# EAGLE design ledmaster (EAGLE 5.11)
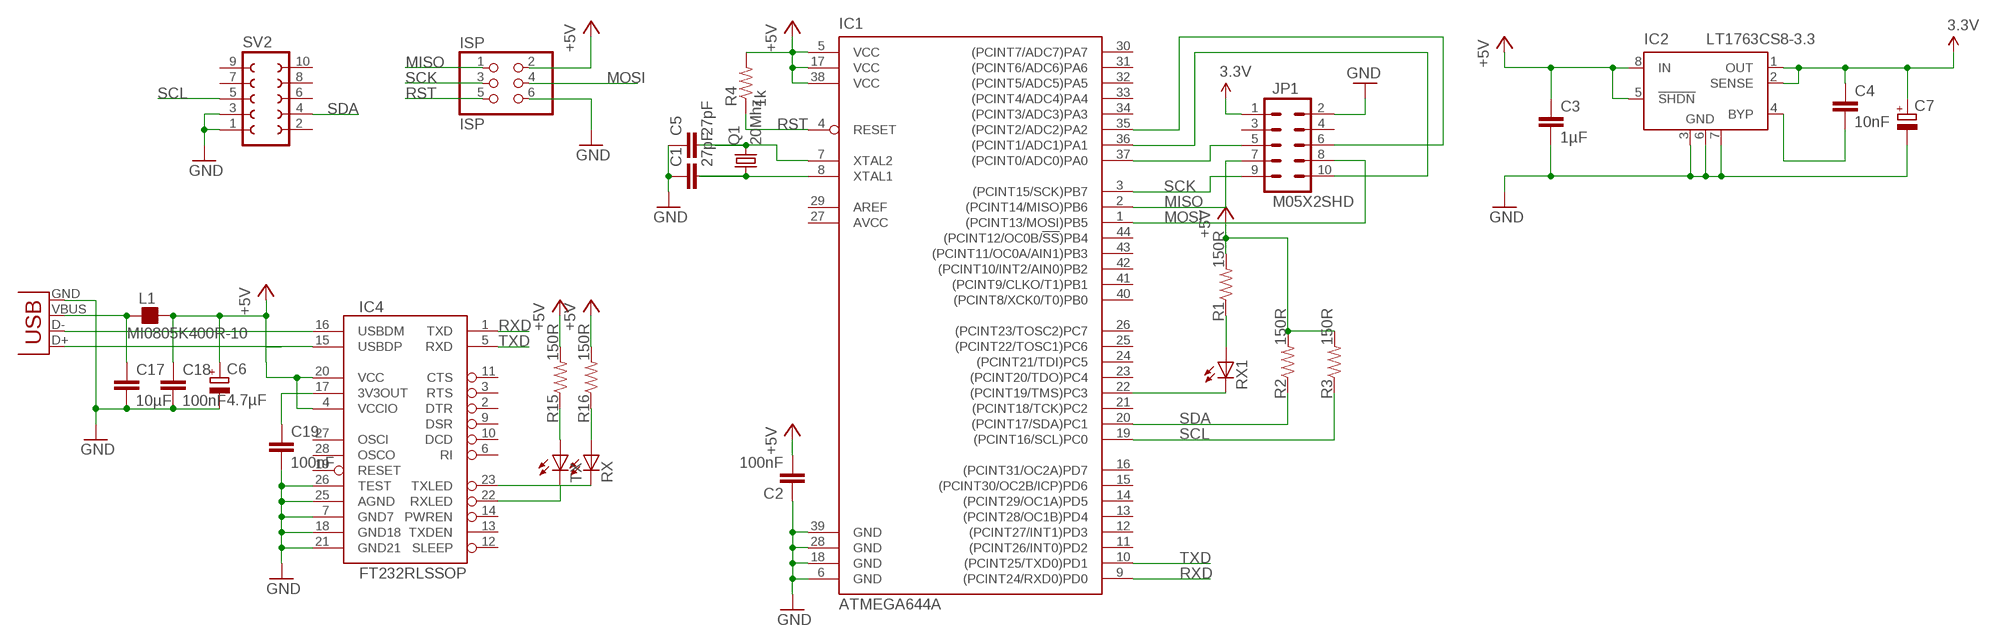
[diagram p0: schematic, sheet 1]

## Parts
C1  27pF  CAP0805  [0805]
C2  100nF  CAP0805  [0805]
C3  1µF  CAP0805  [0805]
C4  10nF  CAP0805  [0805]
C5  27pF  CAP0805  [0805]
C6  4.7µF  CPOL-EUSMCC  [SMC_C]
C7  CPOL-EUSMCC  [SMC_C]
C17  10µF  CAP0805  [0805]
C18  100nF  CAP0805  [0805]
C19  100nF  CAP0805  [0805]
IC1  ATMEGA644A  [TQFP44]
IC2  LT1763CS8-3.3  [SOIC8]
IC4  FT232RLSSOP  [SSOP28DB]
ISP  ISP  PINHD-2X03_2.54  [2X03]
JP1  M05X2SHD  [2X5-SHROUDED]
L1  MI0805K400R-10  FB_0805  [L0805]
Q1  20Mhz  CRYSTALCTS406  [CTS406]
R1  150R  RESISTOR  [0805]
R2  150R  RESISTOR  [0805]
R3  150R  RESISTOR  [0805]
R4  1k  RESISTOR  [0805]
R15  150R  RESISTOR  [0805]
R16  150R  RESISTOR  [0805]
RX  LEDCHIP-LED0805  [CHIP-LED0805]
RX1  LEDCHIP-LED0805  [CHIP-LED0805]
SV2  FE05-2W  [FE05-2W]
TX  LEDCHIP-LED0805  [CHIP-LED0805]
X1  USB-SMD-NS  [USB-MINIB-NOSTOP]

## Nets
3.3V: C4.1 C7.+ IC2.1(OUT) IC2.2(SENSE) JP1.1
+5V: C2.2 C3.1 C6.+ C18.1 IC1.5(VCC) IC1.17(VCC) IC1.38(VCC) IC2.5(!SHDN) IC2.8(IN) IC4.4(VCCIO) IC4.20(VCC) ISP.2 L1.2 R1.2 R2.2 R3.2 R4.2 R15.2 R16.2
GND: C1.1 C2.1 C3.2 C5.1 C6.- C7.- C17.2 C18.2 C19.2 IC1.6(GND) IC1.18(GND) IC1.28(GND) IC1.39(GND) IC2.3(GND) IC2.6(GND) IC2.7(GND) IC4.7(GND7) IC4.18(GND18) IC4.21(GND21) IC4.25(AGND) IC4.26(TEST) ISP.6 JP1.2 SV2.1 SV2.3 X1.GND
MISO: IC1.2((PCINT14/MISO)PB6) ISP.1 JP1.7
MOSI: IC1.1((PCINT13/MOSI)PB5) ISP.4 JP1.8
N$1: IC4.16(USBDM) X1.D-
N$2: IC4.15(USBDP) X1.D+
N$3: C4.2 IC2.4(BYP)
N$4: C17.1 L1.1 X1.VBUS
N$5: R1.1 RX1.A
N$6: IC1.22((PCINT19/TMS)PC3) RX1.C
N$7: IC1.37((PCINT0/ADC0)PA0) JP1.5
N$8: IC1.36((PCINT1/ADC1)PA1) JP1.10
N$9: IC1.35((PCINT2/ADC2)PA2) JP1.6
N$19: R15.1 TX.A
N$20: R16.1 RX.A
N$27: IC4.22(RXLED) TX.C
N$28: IC4.23(TXLED) RX.C
N$29: C19.1 IC4.17(3V3OUT)
N$30: C5.2 IC1.7(XTAL2) Q1.3
N$32: C1.2 IC1.8(XTAL1) Q1.1
RST: IC1.4(RESET) ISP.5 R4.1
RXD: IC1.9((PCINT24/RXD0)PD0) IC4.1(TXD)
SCK: IC1.3((PCINT15/SCK)PB7) ISP.3 JP1.9
SCL: IC1.19((PCINT16/SCL)PC0) R3.1 SV2.5
SDA: IC1.20((PCINT17/SDA)PC1) R2.1 SV2.4
TXD: IC1.10((PCINT25/TXD0)PD1) IC4.5(RXD)
Unconnected: IC1.11((PCINT26/INT0)PD2) IC1.12((PCINT27/INT1)PD3) IC1.13((PCINT28/OC1B)PD4) IC1.14((PCINT29/OC1A)PD5) IC1.15((PCINT30/OC2B/ICP)PD6) IC1.16((PCINT31/OC2A)PD7) IC1.21((PCINT18/TCK)PC2) IC1.23((PCINT20/TDO)PC4) IC1.24((PCINT21/TDI)PC5) IC1.25((PCINT22/TOSC1)PC6) IC1.26((PCINT23/TOSC2)PC7) IC1.29(AREF) IC1.30((PCINT7/ADC7)PA7) IC1.31((PCINT6/ADC6)PA6) IC1.32((PCINT5/ADC5)PA5) IC1.33((PCINT4/ADC4)PA4) IC1.34((PCINT3/ADC3)PA3) IC1.40((PCINT8/XCK0/T0)PB0) IC1.41((PCINT9/CLKO/T1)PB1) IC1.42((PCINT10/INT2/AIN0)PB2) IC1.43((PCINT11/OC0A/AIN1)PB3) IC1.44((PCINT12/OC0B/!SS!)PB4) IC4.2(DTR) IC4.3(RTS) IC4.6(RI) IC4.9(DSR) IC4.10(DCD) IC4.11(CTS) IC4.12(SLEEP) IC4.13(TXDEN) IC4.14(PWREN) IC4.19(RESET) IC4.27(OSCI) IC4.28(OSCO) JP1.3 JP1.4 SV2.2 SV2.6 SV2.7 SV2.8 SV2.9 SV2.10

## Power pins joined to a net without a drawn wire
AVCC: IC1.27(AVCC)

## Library data of the parts
C1-C5 C17-C19 = SparkFun:CAP: Capacitor Standard 0603 ceramic capacitor, and 0.1" leaded capacitor.
C6 C7 = resistor:CPOL-EU: POLARIZED CAPACITOR, European symbol
IC1 = atmel:ATMEGA644: 8-bit Microcontroller with 64K Bytes In-System Programmable Flash Source: http://www.atmel.com/dyn/resources/prod_documents/doc2593.pdf; MPN: ATMEGA644PV-10AU; OC_FARNELL: 1455123; OC_NEWARK: 58M3748
IC2 = linear-technology:LT1763CS8: 500mA, Low Noise, LDO Micropower Regulators Source: http://cds.linear.com/docs/Datasheet/1763ff.pdf
IC4 = SparkFun:FT232RL: USB UART FT232RL 4th Generation USB UART (USB <-> Serial) Controller. Spark Fun Electronics SKU : COM-00650
ISP = pinhead-2:PINHD-2X03: PIN HEADER
JP1 = SparkFun:M05X2: Header 5x2 Standard 10-pin dual row 0.1" header. Commonly used with AVR-ISP. Use with Spark Fun Electronics SKU: PRT-00778
L1 = rc-master-smd:FB_: FERRITE BEAD
Q1 = crystal:CRYSTAL: CRYSTAL
R1-R4 R15 R16 = SparkFun:RESISTOR: Resistor Basic schematic elements and footprints for 0603, 1206, and PTH 1/10th watt (small) resistors.
RX RX1 TX = led:LED: LED OSRAM: - CHIPLED LG R971, LG N971, LY N971, LG Q971, LY Q971, LO R971, LY R971 LH N974, LH R974 LS Q976, LO Q976, LY Q976 LO Q996 - Hyper CHIPLED LW Q18S LB Q993, LB Q99A, LB R99A - SideLED LS A670, LO A670, LY A670, LG A670, LP A670 LB A673, LV A673, LT A673, LW A673 LH A674 LY A675 LS A676, LA A676, LO A676, LY A676, LW A676 LS A679, LY A679, LG A679 - Hyper Micro SIDELED® LS Y876, LA Y876, LO Y876, LY Y876 LT Y87S - SmartLED LW L88C, LW L88S LB L89C, LB L89S, LG L890 LS L89K, LO L89K, LY L89K LS L896, LA L896, LO L896, LY L896 - TOPLED LS T670, LO T670, LY T670, LG T670, LP T670 LSG T670, LSP T670, LSY T670, LOP T670, LYG T670 LG T671, LOG T671, LSG T671 LB T673, LV T673, LT T673, LW T673 LH T674 LS T676, LA T676, LO T676, LY T676, LB T676, LH T676, LSB T676, LW T676 LB T67C, LV T67C, LT T67C, LS T67K, LO T67K, LY T67K, LW E67C LS E67B, LA E67B, LO E67B, LY E67B, LB E67C, LV E67C, LT E67C LW T67C LS T679, LY T679, LG T679 LS T770, LO T770, LY T770, LG T770, LP T770 LB T773, LV T773, LT T773, LW T773 LH T774 LS E675, LA E675, LY E675, LS T675 LS T776, LA T776, LO T776, LY T776, LB T776 LHGB T686 LT T68C, LB T68C - Hyper Mini TOPLED® LB M676 - Mini TOPLED Santana® LG M470 LS M47K, LO M47K, LY M47K Source: http://www.osram.convergy.de LUXEON: - LUMILED® LXK2-PW12-R00, LXK2-PW12-S00, LXK2-PW14-U00, LXK2-PW14-V00 LXK2-PM12-R00, LXK2-PM12-S00, LXK2-PM14-U00 LXK2-PE12-Q00, LXK2-PE12-R00, LXK2-PE12-S00, LXK2-PE14-T00, LXK2-PE14-U00 LXK2-PB12-K00, LXK2-PB12-L00, LXK2-PB12-M00, LXK2-PB14-N00, LXK2-PB14-P00, LXK2-PB14-Q00 LXK2-PR12-L00, LXK2-PR12-M00, LXK2-PR14-Q00, LXK2-PR14-R00 LXK2-PD12-Q00, LXK2-PD12-R00, LXK2-PD12-S00 LXK2-PH12-R00, LXK2-PH12-S00 LXK2-PL12-P00, LXK2-PL12-Q00, LXK2-PL12-R00 Source: www.luxeon.com KINGBRIGHT: KA-3528ASYC Source: www.kingbright.com
SV2 = con-lsta:FE05-2W: FEMALE HEADER
X1 = SparkFun:USB: USB Connectors USB-B-PTH is fully proven SKU : PRT-00139 USB-miniB is fully proven SKU : PRT-00587 USB-A-PCB is untested. USB-A-H is throughly reviewed, but untested. Spark Fun Electronics SKU : PRT-00437 USB-B-SMT is throughly reviewed, but untested. Needs silkscreen touching up. USB-A-S has not been used/tested USB-MB-H has not been used/tested

## Board
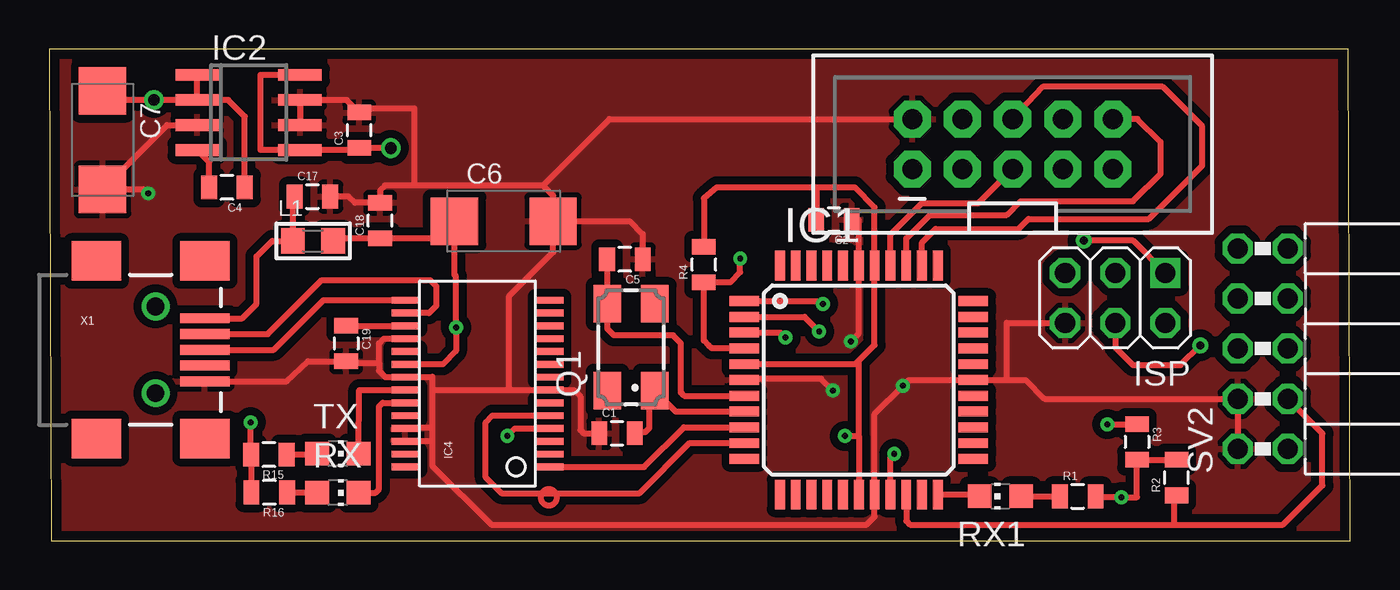
[diagram p1: board, top side]
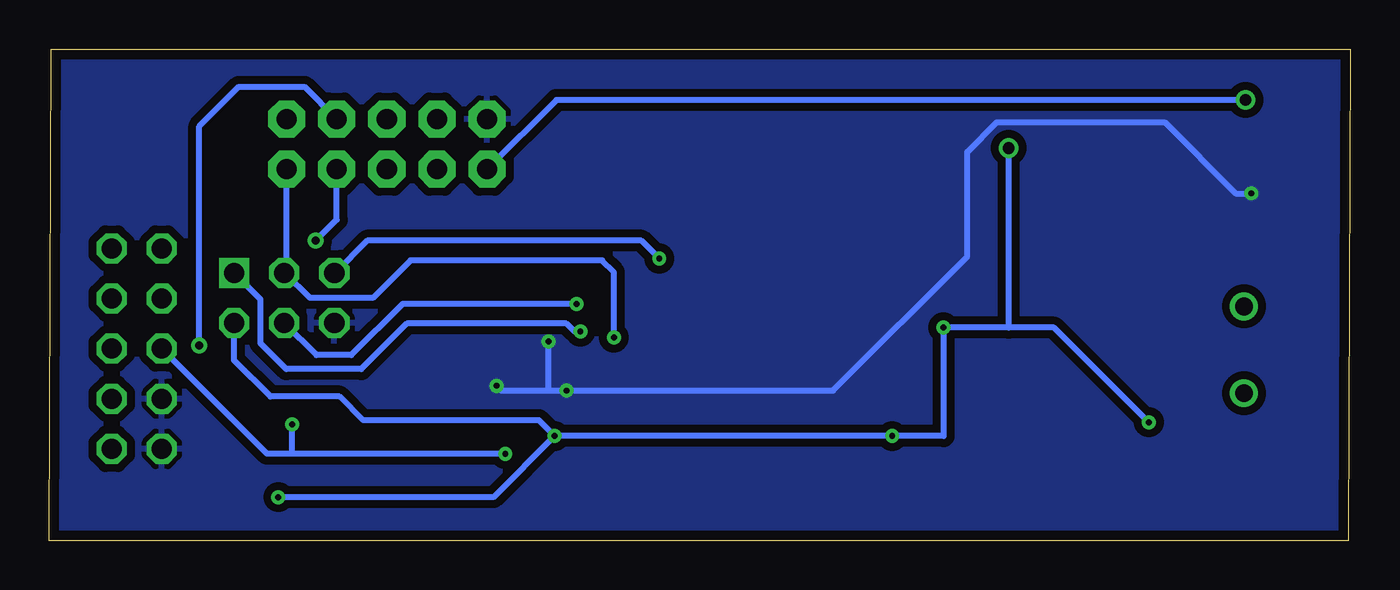
[diagram p2: board, bottom side, seen from below]

Size 65.9 x 24.9 mm. Coordinates in mm from the lower left corner, seen from the top.
Outline: 0.1,0 65.9,0 65.8,24.9 0,24.9 0.1,0
Copper layers (1*16): Top 0.035mm / dielectric 1.5mm / Bottom 0.035mm
Design rules "default *": minimum track width 10mil, minimum drill 0.3mm, track to track 8mil, track to pad 8mil, pad to pad 8mil, via to via 8mil, smd to smd 8mil, copper to edge 20mil, drill to drill 8mil, minimum pad ring 10mil, minimum via ring 8mil, stop-mask expansion 4mil, vias tented up to drill 30mil, thermal gap 10mil

### Footprints (pad centres in the part's own frame; a part is rotated, then mirrored left to right if it is on the bottom)
0805 = smd 0.8 x 1.2: 1 -0.9,0; 2 0.9,0
SMC_C = smd 2.4 x 2.4: + -2.5,0; - 2.5,0
TQFP44 = smd 1.5 x 0.5: 1 -5.8,4; 2 -5.8,3.2; 3 -5.8,2.4; 4 -5.8,1.6; 5 -5.8,0.8; 6 -5.8,0; 7 -5.8,-0.8; 8 -5.8,-1.6; 9 -5.8,-2.4; 10 -5.8,-3.2; 11 -5.8,-4; 23 5.8,-4; 24 5.8,-3.2; 25 5.8,-2.4; 26 5.8,-1.6; 27 5.8,-0.8; 28 5.8,0; 29 5.8,0.8; 30 5.8,1.6; 31 5.8,2.4; 32 5.8,3.2; 33 5.8,4 | smd 0.5 x 1.5: 12 -4,-5.8; 13 -3.2,-5.8; 14 -2.4,-5.8; 15 -1.6,-5.8; 16 -0.8,-5.8; 17 0,-5.8; 18 0.8,-5.8; 19 1.6,-5.8; 20 2.4,-5.8; 21 3.2,-5.8; 22 4,-5.8; 34 4,5.8; 35 3.2,5.8; 36 2.4,5.8; 37 1.6,5.8; 38 0.8,5.8; 39 0,5.8; 40 -0.8,5.8; 41 -1.6,5.8; 42 -2.4,5.8; 43 -3.2,5.8; 44 -4,5.8
SOIC8 = smd 0.6 x 2.2: 1 -1.905,-2.6; 2 -0.635,-2.6; 3 0.635,-2.6; 4 1.905,-2.6; 5 1.905,2.6; 6 0.635,2.6; 7 -0.635,2.6; 8 -1.905,2.6
SSOP28DB = smd 0.348 x 1.397: 1 -4.225,-3.656; 2 -3.575,-3.656; 3 -2.925,-3.656; 4 -2.275,-3.656; 5 -1.625,-3.656; 6 -0.975,-3.656; 7 -0.325,-3.656; 8 0.325,-3.656; 9 0.975,-3.656; 10 1.625,-3.656; 11 2.275,-3.656; 12 2.925,-3.656; 13 3.575,-3.656; 14 4.225,-3.656; 15 4.225,3.656; 16 3.575,3.656; 17 2.925,3.656; 18 2.275,3.656; 19 1.625,3.656; 20 0.975,3.656; 21 0.325,3.656; 22 -0.325,3.656; 23 -0.975,3.656; 24 -1.625,3.656; 25 -2.275,3.656; 26 -2.925,3.656; 27 -3.575,3.656; 28 -4.225,3.656
2X03 = drill 1.016 square: 1 -2.54,-1.27 | drill 1.016 octagon: 2 -2.54,1.27; 3 0,-1.27; 4 0,1.27; 5 2.54,-1.27; 6 2.54,1.27
2X5-SHROUDED = drill 1.016 pad 1.88 octagon: 1 -1.27,5.08; 2 1.27,5.08; 3 -1.27,2.54; 4 1.27,2.54; 5 -1.27,0; 6 1.27,0; 7 -1.27,-2.54; 8 1.27,-2.54; 9 -1.27,-5.08; 10 1.27,-5.08
L0805 = smd 1.2 x 1.3: 1 -1.016,0; 2 1.016,0
CTS406 = smd 1.9 x 1.4: 1 -2.2,-1.2; 2 2.2,-1.2; 3 2.2,1.2; 4 -2.2,1.2
CHIP-LED0805 = smd 1.2 x 1.2: A 0,-1.05; C 0,1.05
FE05-2W = drill 1.016 octagon: 1 -5.08,1.27; 2 -5.08,-1.27; 3 -2.54,1.27; 4 -2.54,-1.27; 5 0,1.27; 6 0,-1.27; 7 2.54,1.27; 8 2.54,-1.27; 9 5.08,1.27; 10 5.08,-1.27
USB-MINIB-NOSTOP = smd 2.5 x 0.5: D+ 2.5,0; D- 2.5,0.8; GND 2.5,-1.6; ID 2.5,-0.8; VBUS 2.5,1.6 | smd 2.5 x 2: G1 -3,-4.5; G2 -3,4.5; G3 2.5,4.5; G4 2.5,-4.5 | drill 0.9 pad 0.8 round: H1 0,2.2 | drill 0.9 pad 0.787 round: H2 0,-2.2

### Placement (x,y rotation side)
C1  28.76,5.44 0 top
C2  39.75,16.26 180 top
C3  15.7,20.8 90 top
C4  9,17.9 180 top
C5  29.16,14.26 180 top
C6  23.02,16.19 0 top
C7  2.7,20.3 270 top
C17  13.33,17.44 0 top
C18  16.76,16.22 90 top
C19  15.04,9.99 270 top
IC1  41.01,8.14 0 top
IC2  10.1,21.7 270 top
IC4  21.69,7.96 90 top
ISP  54,12.3 180 top
JP1  48.8,20.1 90 top
L1  13.36,15.19 0 top
Q1  29.47,9.8 90 top
R1  52.1,2.24 0 top
R2  57.1,3.2 90 top
R3  55.1,5 270 top
R4  33.16,13.99 90 top
R15  11.12,4.36 180 top
R16  11.14,2.45 180 top
RX  14.62,2.43 270 top
RX1  48.18,2.25 90 top
SV2  61.47,9.73 90 top
TX  14.62,4.41 270 top
X1  5.38,9.67 0 top

### Tracks (layer width: path | path; a pad name or v marks a point on that pad's centre or on a via)
3.3V  (via drill 0.6)
  Top 0.305: C7.+ 3.17,22.34 v5.3,22.34 IC2.2 | IC2.2 IC2.1 | C4.1 9.9,21.5 9.06,22.34 IC2.2
  Bottom 0.305: v5.3,22.34 20.2,22.34 20.9,22.34 40.22,22.34 JP1.1
+5V  (via drill 0.3, 0.6)
  Top 0.305: L1.2 14.51,15.32 C18.1 19.75,15.32 C6.+ 20.52,13.48 20.6,13.4 v20.6,10.8 20.6,9.6 19.94,8.93 IC4.20 | 10.24,4.34 R15.2 | R16.2 10.24,4.34 | 10.24,4.34 10.2,4.34 v10.2,6 | IC1.5 40.84,8.94 40.95,9.05 | 40.95,9.05 41.81,9.91 IC1.38 41.81,16.89 40.8,17.9 38.85,17.9 | 41.01,5.3 41.01,8.99 40.95,9.05 | v23.2,5.3 23.59,5.68 IC4.4 | v40.3,5.3 41.01,5.3 | 41.01,5.3 IC1.17 | v54.3,2.2 54.26,2.24 | R2.2 R3.2 55.1,2.2 v54.3,2.2 | R1.2 53,2.2 v54.3,2.2 | R4.2 33.16,17.36 33.8,17.9 38.85,17.9 | IC2.8 10.7,23.6 10.7,19.8 IC2.5 15.7,19.8 C3.1 v17.3,19.9 | 38.85,17.9 C2.2
  Bottom 0.305: v10.2,6 15,10.8 17.3,10.8 | v40.3,5.3 v23.2,5.3 20.6,5.3 v20.6,10.8 17.3,10.8 | v54.3,2.2 43.4,2.2 v40.3,5.3 | ISP.2 56.54,9.14 54.7,7.3 51.2,7.3 50,6.1 41.1,6.1 v40.3,5.3 | 17.3,10.8 v17.3,19.9
GND  (via drill 0.3)
  Top 0.305: 19.4,7.63 19.4,8.3 18.05,8.3 IC4.21 17.02,8.28 16.7,8.6 16.7,9 | IC4.25 18.05,5.7 19.4,5.7 | C17.2 15.16,17.44 15.48,17.12 C18.2 16.76,17.76 17,18 18.5,18 | 25,18 25.52,17.48 C6.- | IC4.18 16.94,10.23 16.7,10 16.7,9 | 19.4,7.63 23.4,7.63 | 23.4,7.63 IC4.7 26.57,7.63 26.9,7.3 26.9,5.6 27.06,5.44 C1.1 | 19.4,7.63 19.4,5.7 | X1.GND 12.03,8.07 13.11,9.09 C19.2 15.13,9 16.7,9 | C5.1 30.06,15.54 29.41,16.19 C6.- | C6.- 25.52,14.62 23.3,12.4 23.3,7.73 23.4,7.63 | IC1.6 35.27,8.2 39.1,8.2 v39.7,7.6 | v40.6,10.1 41.01,10.51 IC1.39 41.01,16.26 C2.1 | 19.4,5.03 19.4,3.8 22.4,0.8 41.4,0.8 41.81,1.21 IC1.18 41.81,6.41 v43.25,7.85 43.54,8.14 IC1.28 48.5,8.14 | 19.4,5.03 IC4.26 | 19.4,5.7 19.4,5.03 | SV2.1 SV2.3 50.41,7.19 49.46,8.14 48.5,8.14 | ISP.6 48.5,11.03 48.5,8.14 | IC2.6 IC2.7 15.06,22.34 C3.2 15.7,21.9 18.5,21.9 18.5,18 | C7.- 5.96,21.06 IC2.3 | 25,18 18.5,18 | C7.- 2.7,17.6 | v5,17.6 4.8,17.8 C7.- | JP1.2 28.37,21.37 25,18
  Bottom 0.305: 40.7,7.6 43,7.6 v43.25,7.85 | 40.7,7.6 v39.7,7.6 26.2,7.6 19.4,14.4 19.4,19.7 17.9,21.2 9.4,21.2 5.8,17.6 v5,17.6 | v40.6,10.1 40.6,7.7 40.7,7.6
  pour Top (isolate 0.4): 0.1,-0.1 65.9,-0.1 65.9,24.9 0.1,24.9
  pour Bottom (isolate 0.4): 0.1,24.9 65.9,24.9 65.9,0 0.1,0
MISO  (via drill 0.3, 0.4)
  Top 0.305: IC1.2 38.26,11.34 v39,10.6 | v52.4,15.2 54.91,15.2 ISP.1
  Bottom 0.305: v39,10.6 39.3,10.6 39.7,11 47.8,11 50.1,8.7 53.9,8.7 55.2,10 55.2,12.23 ISP.1 | JP1.7 51.34,16.26 v52.4,15.2
MOSI  (via drill 0.3, 0.4)
  Top 0.305: IC1.1 39.06,12.14 v39.2,12 | v58.3,9.9 57.3,8.9 54.9,8.9 54,9.8 ISP.4
  Bottom 0.305: v39.2,12 48,12 50.6,9.4 52.37,9.4 ISP.4 | JP1.8 52.97,23 56.3,23 58.3,21 v58.3,9.9
N$1
  Top 0.305: X1.D- 11.07,10.47 13.8,13.2 19.3,13.2 19.6,12.9 19.6,11.9 19.24,11.53 IC4.16
N$2
  Top 0.305: IC4.15 13.88,12.18 11.37,9.67 X1.D+
N$3
  Top 0.305: C4.2 8.1,19.2 IC2.4
N$4
  Top 0.305: X1.VBUS 9.77,11.27 10.5,12 10.5,14.4 11.29,15.19 L1.1 12.34,17.35 C17.1
N$5
  Top 0.305: RX1.A R1.1
N$6
  Top 0.305: RX1.C 47.04,2.34 IC1.22
N$7
  Top 0.305: IC1.37 42.61,15.51 44.2,17.1 47.07,17.1 JP1.5
N$8
  Top 0.305: IC1.36 43.41,15.31 44.6,16.5 48.5,16.5 49.2,17.2 54.9,17.2 56.3,18.6 56.3,20.2 55.13,21.37 JP1.10
N$9
  Top 0.305: IC1.35 44.21,15.11 44.9,15.8 49.1,15.8 49.6,16.3 55.7,16.3 58.4,19 58.4,21 56.4,23 50.33,23 JP1.6
N$19
  Top 0.305: TX.A 13.52,4.36 R15.1
N$20
  Top 0.305: RX.A 13.55,2.45 R16.1
N$27
  Top 0.305: IC4.22 15.7,7.63 TX.C
N$28
  Top 0.305: IC4.23 16.89,6.98 16.7,6.8 16.7,2.6 16.53,2.43 RX.C
N$29
  Top 0.305: IC4.17 C19.1
N$30
  Top 0.305: IC1.7 32.16,7.34 32,7.5 32,10 31.6,10.4 28.6,10.4 28.27,10.73 Q1.3 28.27,14.07 C5.2
N$32
  Top 0.305: IC1.8 31.73,6.54 Q1.1 30.17,7.13 30.4,6.9 30.4,5.7 30.2,5.5 29.72,5.5 C1.2
RST  (via drill 0.3)
  Top 0.305: IC1.4 33.56,9.74 33.4,9.9 33.16,10.14 R4.1 34.5,13.1 35,13.6 v35,14.3
  Bottom 0.305: ISP.5 51.43,13.57 49.8,15.2 35.9,15.2 v35,14.3
RXD
  Top 0.305: IC1.9 32.14,5.74 30.14,3.73 IC4.1
SCK  (via drill 0.3)
  Top 0.305: v37.3,10.3 37.04,10.54 IC1.3
  Bottom 0.305: v37.3,10.3 37.3,13.6 37.9,14.2 47.6,14.2 49.5,12.3 52.7,12.3 53.97,13.57 ISP.3 53.88,13.69 JP1.9
SCL  (via drill 0.3)
  Top 0.305: IC1.19 42.61,4.21 v42.8,4.4 | v53.6,5.9 R3.1
  Bottom 0.305: v42.8,4.4 45.5,4.4 53.5,4.4 | 53.5,4.4 54.87,4.4 SV2.5 | v53.6,5.9 53.6,4.4 53.5,4.4
SDA
  Top 0.305: IC1.20 43.41,0.99 43.6,0.8 57,0.8 | 57,0.8 62.5,0.8 64.5,2.8 64.5,5.43 SV2.4 | R2.1 57,2.3 57,0.8
TXD
  Top 0.305: IC4.5 22.44,6.34 22.1,6 22.1,3.2 22.9,2.4 29.9,2.4 32.44,4.94 IC1.10
(copper drawn outside any net)
  shapes: Top circle x1

### Text on the board
tStop: LED-Master v2 | seb@exse.net <<</>> | GND
bStop: GND | LED-Master seb@exse.net <<</>>